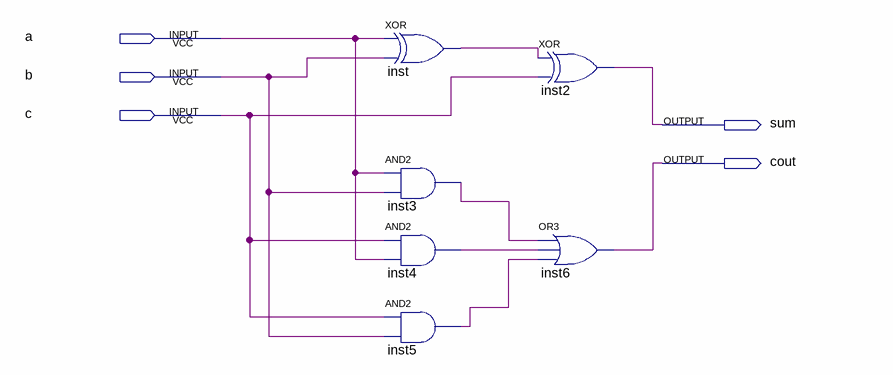
[diagram p0: schematic sheet]
// Quartus schematic adder.bdf as structural Verilog: 6 symbols, 5 pins
module adder (
  input  a,
  input  b,
  input  c,
  output sum,
  output cout
);

  wire inst3_out, inst4_out, inst5_out, inst_out;

  xor inst (inst_out, a, b);
  and inst3 (inst3_out, a, b);
  and inst4 (inst4_out, c, a);
  and inst5 (inst5_out, c, b);
  xor inst2 (sum, inst_out, c);
  or inst6 (cout, inst3_out, inst4_out, inst5_out);
endmodule
